# Altium project Oscope_Boards.PrjPcb
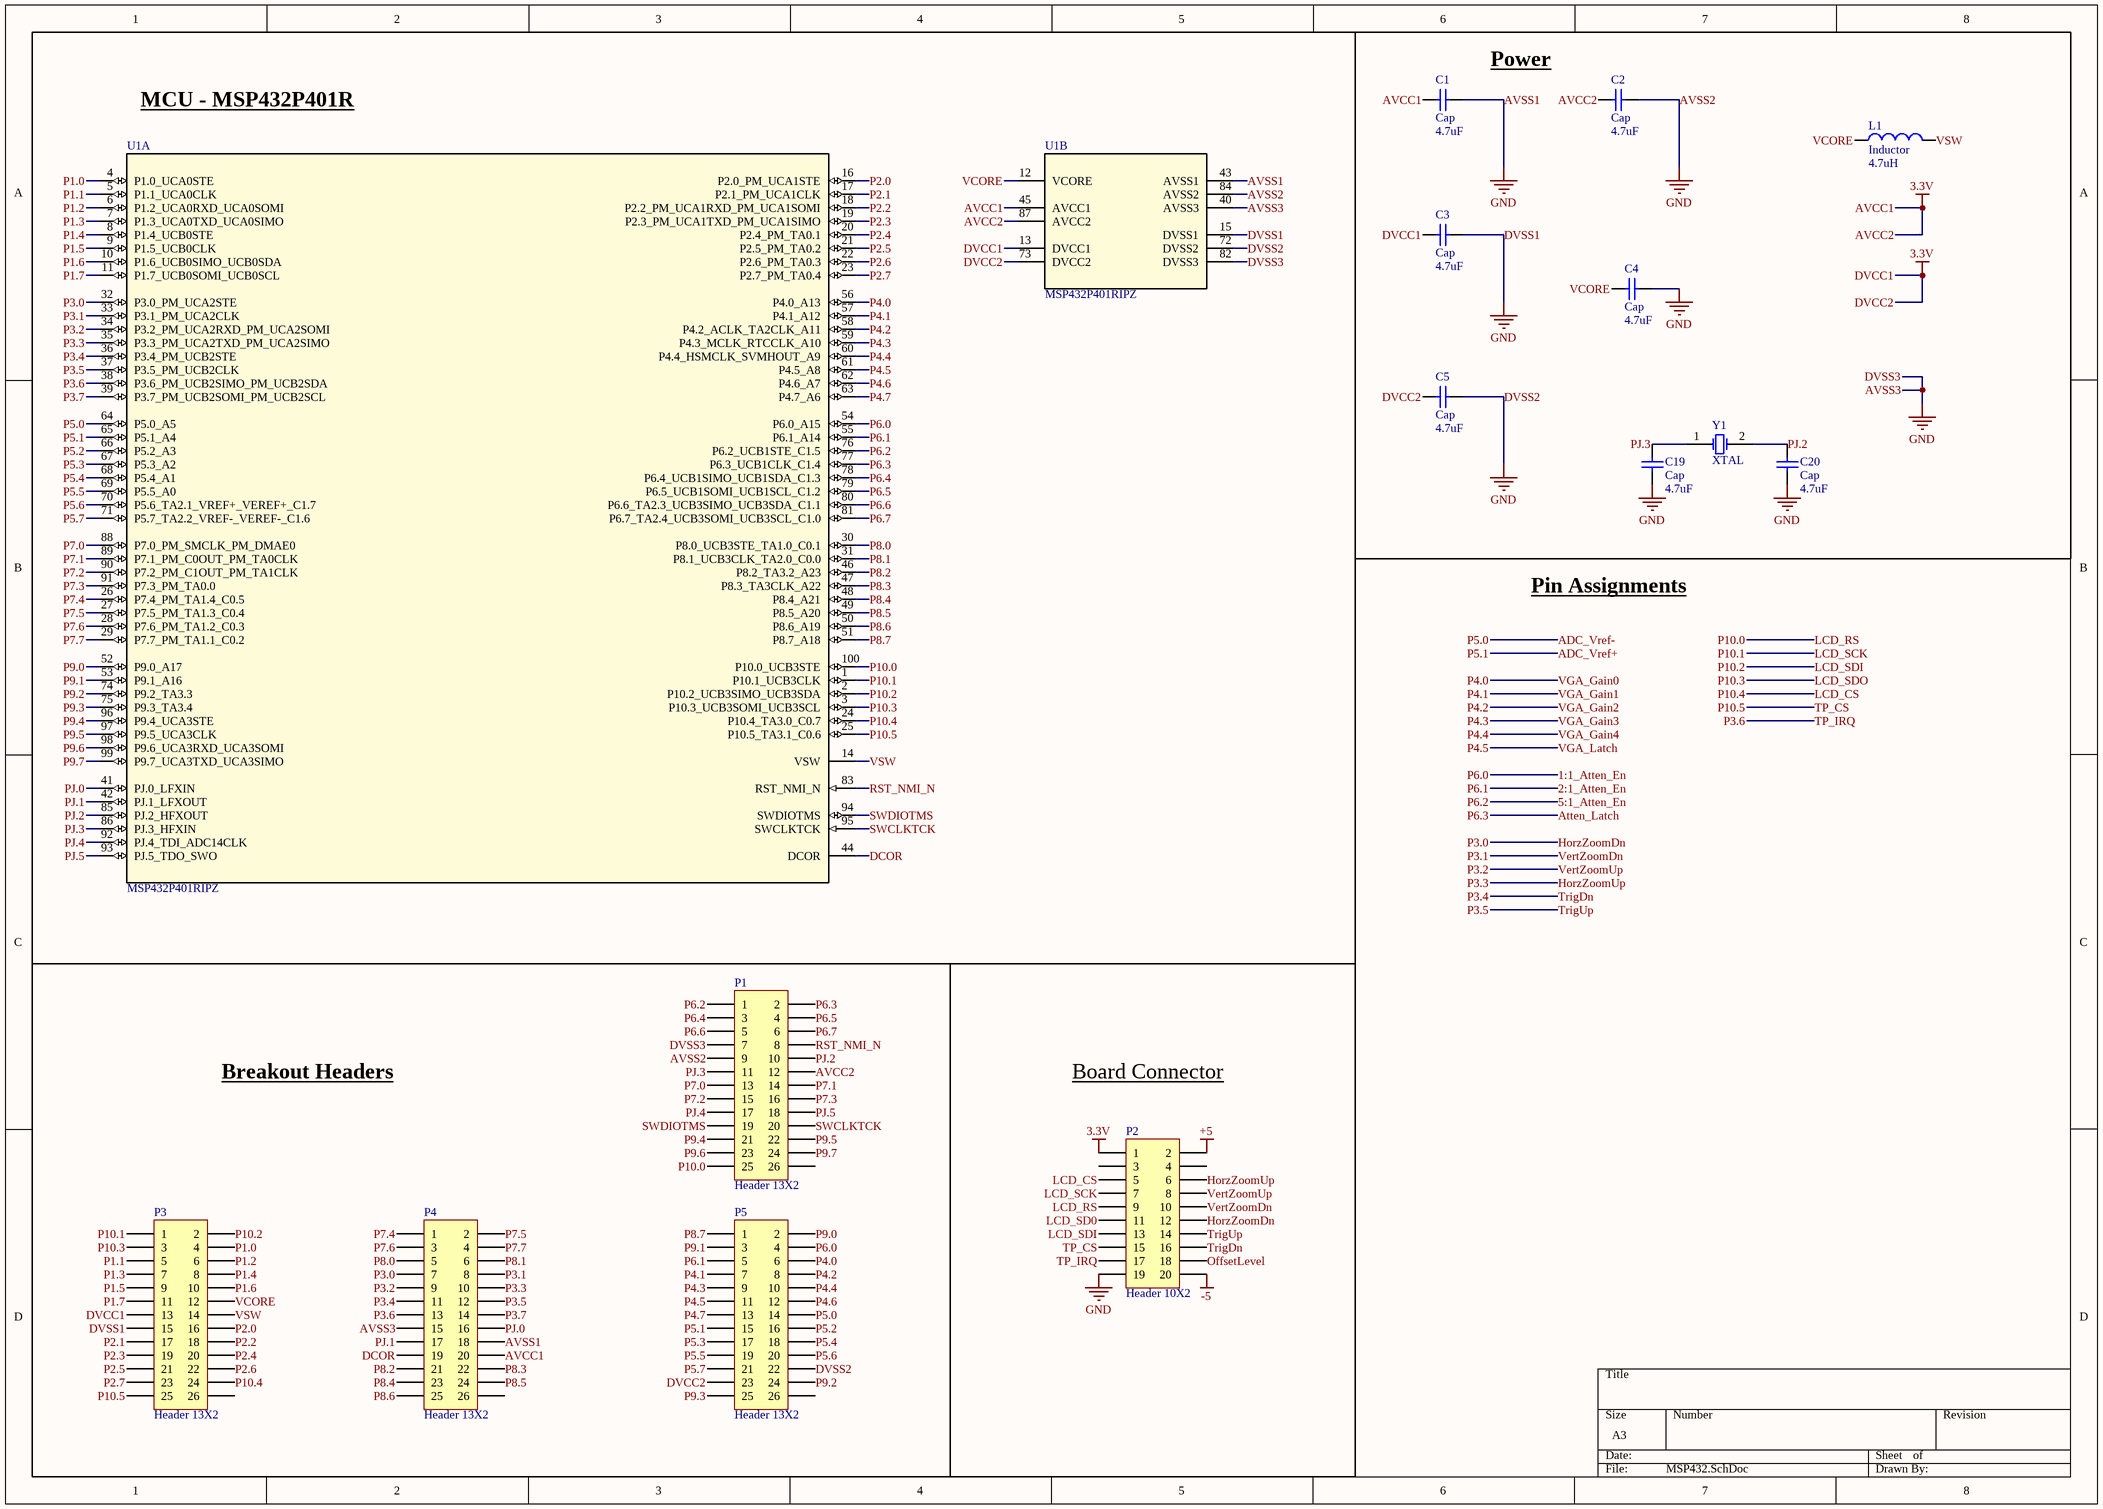
[diagram p0: MSP432.SchDoc]
4 sheets, 64 parts. Net scope: global (net labels, ports and power ports of the same name join across sheets).
Board files: InterfaceBoard.PcbDoc, MainBoard.PcbDoc, EvalBoard.PcbDoc
Sheets:
  MSP432.SchDoc
  FrontEndCircuit.SchDoc
  InterfaceBoard.SchDoc
  PowerCircuit.SchDoc

## Sheet MSP432.SchDoc
size A3

### Parts
C1  Cap  value 4.7uF  [6-0805_N]
C2  Cap  value 4.7uF  [6-0805_N]
C3  Cap  value 4.7uF  [6-0805_N]
C4  Cap  value 4.7uF  [6-0805_N]
C5  Cap  value 4.7uF  [6-0805_N]
C19  Cap  value 4.7uF  [6-0805_N]
C20  Cap  value 4.7uF  [6-0805_N]
L1  Inductor  value 4.7uH  [6-0805_N]
P1  Header 13X2  [HDR2X13]
P2  Header 10X2  [HDR2X10]
P3  Header 13X2  [HDR2X13]
P4  Header 13X2  [HDR2X13]
P5  Header 13X2  [HDR2X13]
U1  MSP432P401RIPZ  [PZ0100A_N]  (parts A,B of 2)
Y1  XTAL  [HC-49U]

### Blocks framed on the sheet
MCU - MSP432P401R: U1
Power: C1-C5 C19 C20 L1 Y1
Breakout Headers: P1 P3-P5
Board Connector: P2

### Nets
+5: P2.2
-5: P2.20
AVCC1: C1.1 C2.1 C3.1 C5.1 P1.12 P2.1 P3.13 P4.20 P5.23 U1.13(DVCC1) U1.45(AVCC1) U1.73(DVCC2) U1.87(AVCC2)  [also labelled 3.3V, AVCC2, DVCC1, DVCC2]
AVSS1: C1.2 C2.2 C3.2 C4.2 C5.2 C19.1 C20.2 P1.7 P1.9 P2.19 P3.15 P4.15 P4.18 P5.22 U1.15(DVSS1) U1.40(AVSS3) U1.43(AVSS1) U1.72(DVSS2) U1.82(DVSS3) U1.84(AVSS2)  [also labelled AVSS2, AVSS3, DVSS1, DVSS2, DVSS3, GND]
1:1_Atten_En: P5.4 U1.54(P6.0_A15)  [also labelled P6.0]
2:1_Atten_En: P5.5 U1.55(P6.1_A14)  [also labelled P6.1]
5:1_Atten_En: P1.1 U1.76(P6.2_UCB1STE_C1.5)  [also labelled P6.2]
ADC_Vref+: P5.15 U1.65(P5.1_A4)  [also labelled P5.1]
ADC_Vref-: P5.14 U1.64(P5.0_A5)  [also labelled P5.0]
Atten_Latch: P1.2 U1.77(P6.3_UCB1CLK_C1.4)  [also labelled P6.3]
DCOR: P4.19 U1.44(DCOR)
HorzZoomDn: P2.12 P4.7 U1.32(P3.0_PM_UCA2STE)  [also labelled P3.0]
HorzZoomUp: P2.6 P4.10 U1.35(P3.3_PM_UCA2TXD_PM_UCA2SIMO)  [also labelled P3.3]
LCD_CS: P2.5 P3.24 U1.24(P10.4_TA3.0_C0.7)  [also labelled P10.4]
LCD_RS: P1.25 P2.9 U1.100(P10.0_UCB3STE)  [also labelled P10.0]
LCD_SCK: P2.7 P3.1 U1.1(P10.1_UCB3CLK)  [also labelled P10.1]
LCD_SD0: P2.11
LCD_SDI: P2.13 P3.2 U1.2(P10.2_UCB3SIMO_UCB3SDA)  [also labelled P10.2]
LCD_SDO: P3.3 U1.3(P10.3_UCB3SOMI_UCB3SCL)  [also labelled P10.3]
OffsetLevel: P2.18
P1.0: P3.4 U1.4(P1.0_UCA0STE)
P1.1: P3.5 U1.5(P1.1_UCA0CLK)
P1.2: P3.6 U1.6(P1.2_UCA0RXD_UCA0SOMI)
P1.3: P3.7 U1.7(P1.3_UCA0TXD_UCA0SIMO)
P1.4: P3.8 U1.8(P1.4_UCB0STE)
P1.5: P3.9 U1.9(P1.5_UCB0CLK)
P1.6: P3.10 U1.10(P1.6_UCB0SIMO_UCB0SDA)
P1.7: P3.11 U1.11(P1.7_UCB0SOMI_UCB0SCL)
P2.0: P3.16 U1.16(P2.0_PM_UCA1STE)
P2.1: P3.17 U1.17(P2.1_PM_UCA1CLK)
P2.2: P3.18 U1.18(P2.2_PM_UCA1RXD_PM_UCA1SOMI)
P2.3: P3.19 U1.19(P2.3_PM_UCA1TXD_PM_UCA1SIMO)
P2.4: P3.20 U1.20(P2.4_PM_TA0.1)
P2.5: P3.21 U1.21(P2.5_PM_TA0.2)
P2.6: P3.22 U1.22(P2.6_PM_TA0.3)
P2.7: P3.23 U1.23(P2.7_PM_TA0.4)
P3.1: P2.10 P4.8 U1.33(P3.1_PM_UCA2CLK)  [also labelled VertZoomDn]
P3.2: P2.8 P4.9 U1.34(P3.2_PM_UCA2RXD_PM_UCA2SOMI)  [also labelled VertZoomUp]
P3.4: P2.16 P4.11 U1.36(P3.4_PM_UCB2STE)  [also labelled TrigDn]
P3.5: P2.14 P4.12 U1.37(P3.5_PM_UCB2CLK)  [also labelled TrigUp]
P3.6: P2.17 P4.13 U1.38(P3.6_PM_UCB2SIMO_PM_UCB2SDA)  [also labelled TP_IRQ]
P3.7: P4.14 U1.39(P3.7_PM_UCB2SOMI_PM_UCB2SCL)
P4.0: P5.6 U1.56(P4.0_A13)  [also labelled VGA_Gain0]
P4.1: P5.7 U1.57(P4.1_A12)  [also labelled VGA_Gain1]
P4.2: P5.8 U1.58(P4.2_ACLK_TA2CLK_A11)  [also labelled VGA_Gain2]
P4.3: P5.9 U1.59(P4.3_MCLK_RTCCLK_A10)  [also labelled VGA_Gain3]
P4.4: P5.10 U1.60(P4.4_HSMCLK_SVMHOUT_A9)  [also labelled VGA_Gain4]
P4.5: P5.11 U1.61(P4.5_A8)  [also labelled VGA_Latch]
P4.6: P5.12 U1.62(P4.6_A7)
P4.7: P5.13 U1.63(P4.7_A6)
P5.2: P5.16 U1.66(P5.2_A3)
P5.3: P5.17 U1.67(P5.3_A2)
P5.4: P5.18 U1.68(P5.4_A1)
P5.5: P5.19 U1.69(P5.5_A0)
P5.6: P5.20 U1.70(P5.6_TA2.1_VREF+_VEREF+_C1.7)
P5.7: P5.21 U1.71(P5.7_TA2.2_VREF-_VEREF-_C1.6)
P6.4: P1.3 U1.78(P6.4_UCB1SIMO_UCB1SDA_C1.3)
P6.5: P1.4 U1.79(P6.5_UCB1SOMI_UCB1SCL_C1.2)
P6.6: P1.5 U1.80(P6.6_TA2.3_UCB3SIMO_UCB3SDA_C1.1)
P6.7: P1.6 U1.81(P6.7_TA2.4_UCB3SOMI_UCB3SCL_C1.0)
P7.0: P1.13 U1.88(P7.0_PM_SMCLK_PM_DMAE0)
P7.1: P1.14 U1.89(P7.1_PM_C0OUT_PM_TA0CLK)
P7.2: P1.15 U1.90(P7.2_PM_C1OUT_PM_TA1CLK)
P7.3: P1.16 U1.91(P7.3_PM_TA0.0)
P7.4: P4.1 U1.26(P7.4_PM_TA1.4_C0.5)
P7.5: P4.2 U1.27(P7.5_PM_TA1.3_C0.4)
P7.6: P4.3 U1.28(P7.6_PM_TA1.2_C0.3)
P7.7: P4.4 U1.29(P7.7_PM_TA1.1_C0.2)
P8.0: P4.5 U1.30(P8.0_UCB3STE_TA1.0_C0.1)
P8.1: P4.6 U1.31(P8.1_UCB3CLK_TA2.0_C0.0)
P8.2: P4.21 U1.46(P8.2_TA3.2_A23)
P8.3: P4.22 U1.47(P8.3_TA3CLK_A22)
P8.4: P4.23 U1.48(P8.4_A21)
P8.5: P4.24 U1.49(P8.5_A20)
P8.6: P4.25 U1.50(P8.6_A19)
P8.7: P5.1 U1.51(P8.7_A18)
P9.0: P5.2 U1.52(P9.0_A17)
P9.1: P5.3 U1.53(P9.1_A16)
P9.2: P5.24 U1.74(P9.2_TA3.3)
P9.3: P5.25 U1.75(P9.3_TA3.4)
P9.4: P1.21 U1.96(P9.4_UCA3STE)
P9.5: P1.22 U1.97(P9.5_UCA3CLK)
P9.6: P1.23 U1.98(P9.6_UCA3RXD_UCA3SOMI)
P9.7: P1.24 U1.99(P9.7_UCA3TXD_UCA3SIMO)
P10.5: P2.15 P3.25 U1.25(P10.5_TA3.1_C0.6)  [also labelled TP_CS]
PJ.0: P4.16 U1.41(PJ.0_LFXIN)
PJ.1: P4.17 U1.42(PJ.1_LFXOUT)
PJ.2: C20.1 P1.10 U1.85(PJ.2_HFXOUT) Y1.2(OSC2)
PJ.3: C19.2 P1.11 U1.86(PJ.3_HFXIN) Y1.1(OSC1)
PJ.4: P1.17 U1.92(PJ.4_TDI_ADC14CLK)
PJ.5: P1.18 U1.93(PJ.5_TDO_SWO)
RST_NMI_N: P1.8 U1.83(RST_NMI_N)
SWCLKTCK: P1.20 U1.95(SWCLKTCK)
SWDIOTMS: P1.19 U1.94(SWDIOTMS)
VCORE: C4.1 L1.1 P3.12 U1.12(VCORE)
VSW: L1.2 P3.14 U1.14(VSW)

Not connected (* = marked no-connect by the designer): P1 26; P2 3 4; P3 26; P4 26; P5 26

### Notes on the sheet
- Pin Assignments

### Library data of the parts
C1-C5 C19 C20 = Cap: Capacitor; Published: 8-Jun-2000; LatestRevisionDate: 17-Jul-2002; LatestRevisionNote: Re-released for DXP Platform.; PackageReference: RAD-0.3; Publisher: Altium Limited; PackageDescription: Radial Cap, Thru-Hole; 2 Leads; 0.3 in Pin Spacing
L1 = Inductor: Code_IEC: 1005; Published: 8-Jun-2000; LatestRevisionDate: 29-May-2009; LatestRevisionNote: IPC-7351 Footprint Added.; PackageReference: 0402-A; Publisher: Altium Limited; PackageDescription: Chip Inductor; Code_JEITA: 0402
P1 P3-P5 = Header 13X2: Header, 13-Pin, Dual row; LatestRevisionDate: 17-Jul-2002; LatestRevisionNote: Re-released for DXP Platform.; Publisher: Altium Limited
P2 = Header 10X2: Header, 10-Pin, Dual row; LatestRevisionDate: 17-Jul-2002; LatestRevisionNote: Re-released for DXP Platform.; Publisher: Altium Limited
U1 = MSP432P401RIPZ: No Description Available; PartNumber: XMS432P401RIPZR; Manufacturer: Texas Instruments; CompType: IC; PIN_COUNT: 100; PackageReference: PZ0100A; MountType: SMT; RefDes: RefDes; Type: DEV; Value: Value; Copyright: Copyright (C) 2018 Accelerated Designs. All rights reserved
Y1 = XTAL: Crystal Oscillator; Published: 8-Jun-2000; LatestRevisionDate: 17-Jul-2002; LatestRevisionNote: Re-released for DXP Platform.; PackageReference: R38; Publisher: Altium Limited; PackageDescription: Crystal, Thru-Hole; 2 Leads; Body 3.1 x 8.2 mm (Dia.xH)

## Sheet FrontEndCircuit.SchDoc
size A3
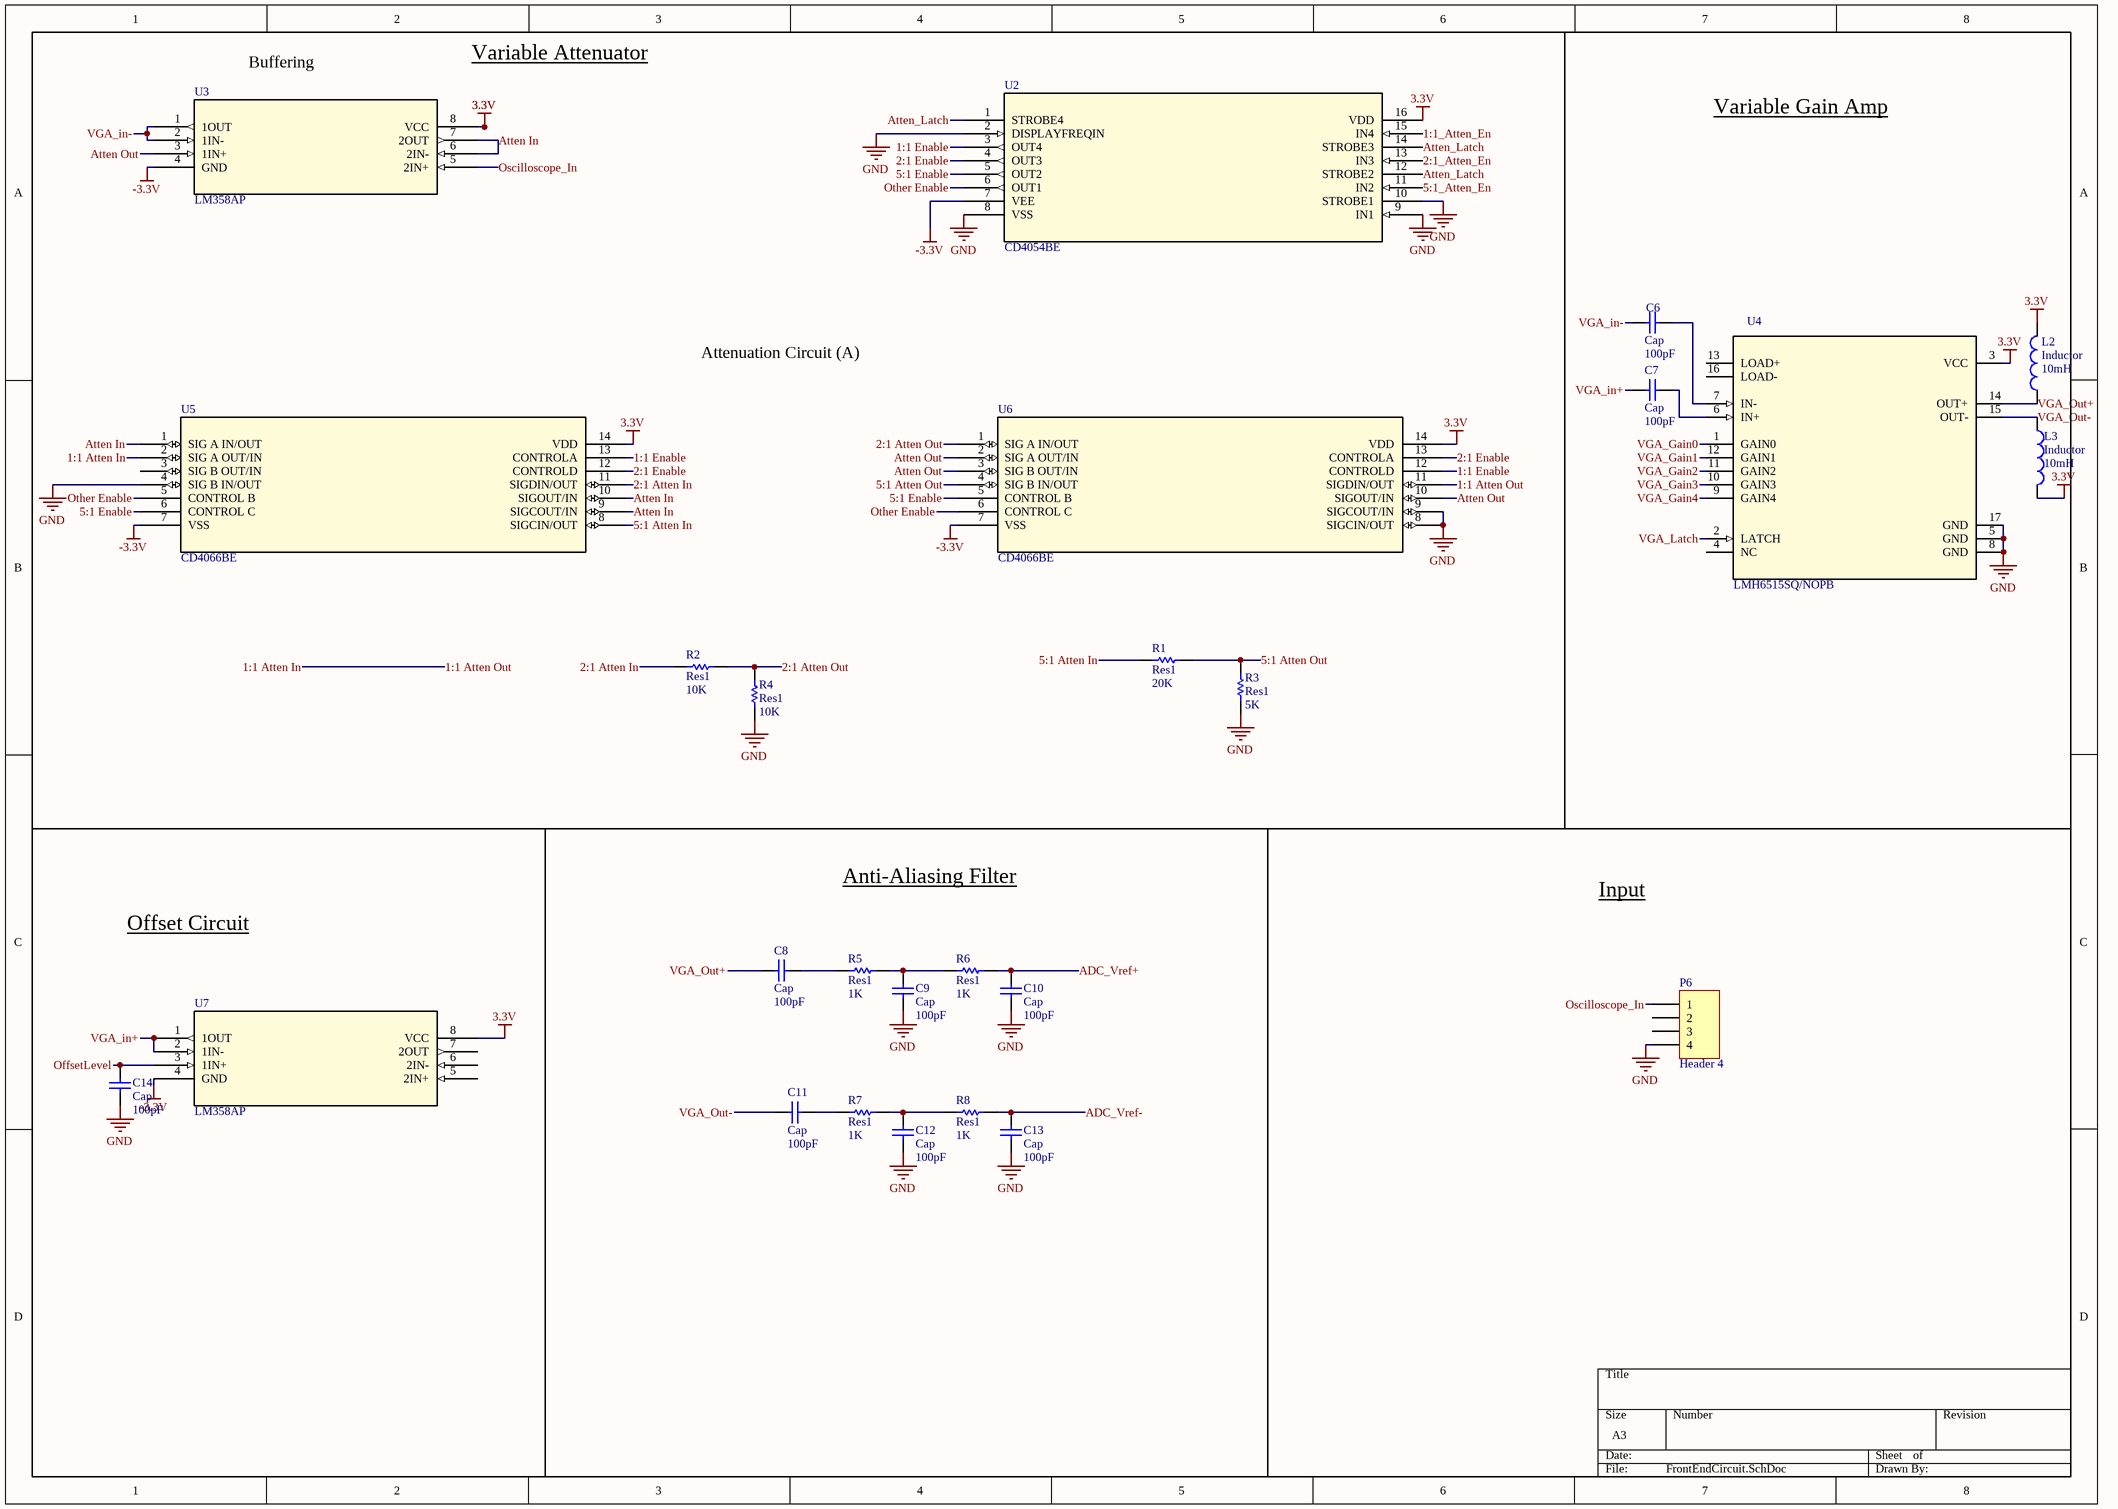
[diagram p1: FrontEndCircuit.SchDoc]

### Parts
C6  Cap  value 100pF  [6-0805_N]
C7  Cap  value 100pF  [6-0805_N]
C8  Cap  value 100pF  [6-0805_N]
C9  Cap  value 100pF  [6-0805_N]
C10  Cap  value 100pF  [6-0805_N]
C11  Cap  value 100pF  [6-0805_N]
C12  Cap  value 100pF  [6-0805_N]
C13  Cap  value 100pF  [6-0805_N]
C14  Cap  value 100pF  [6-0805_N]
L2  Inductor  value 10mH  [6-0805_N]
L3  Inductor  value 10mH  [6-0805_N]
P6  Header 4  [HDR1X4]
R1  Res1  value 20K  [AXIAL-0.3]
R2  Res1  value 10K  [AXIAL-0.3]
R3  Res1  value 5K  [AXIAL-0.3]
R4  Res1  value 10K  [AXIAL-0.3]
R5  Res1  value 1K  [AXIAL-0.3]
R6  Res1  value 1K  [AXIAL-0.3]
R7  Res1  value 1K  [AXIAL-0.3]
R8  Res1  value 1K  [AXIAL-0.3]
U2  CD4054BE  [N16]
U3  LM358AP  [P8]
U4  LMH6515SQ/NOPB  [SQA16A]
U5  CD4066BE  [N14]
U6  CD4066BE  [N14]
U7  LM358AP  [P8]

### Blocks framed on the sheet
Variable Attenuator: R1-R4 U2 U3 U5 U6
Variable Gain Amp: C6 C7 L2 L3 U4
Offset Circuit: C14 U7
Anti-Aliasing Filter: C8-C13 R5-R8
Input: P6

### Nets
3.3V: L2.2 L3.2 U2.16(VDD) U3.8(VCC) U4.3(VCC) U5.14(VDD) U6.14(VDD) U7.8(VCC)  [project net AVCC1]
-3.3V: U2.7(VEE) U3.4(GND) U5.7(VSS) U6.7(VSS) U7.4(GND)
GND: C9.1 C10.1 C12.1 C13.1 C14.1 P6.4 R3.1 R4.1 U2.2(DISPLAYFREQIN) U2.8(VSS) U2.9(IN1) U2.10(STROBE1) U4.5(GND) U4.8(GND) U4.17(GND) U5.4(SIG_B_IN/OUT) U6.8(SIGCIN/OUT) U6.9(SIGCOUT/IN)  [project net AVSS1]
1:1 Atten In: U5.2(SIG_A_OUT/IN) U6.11(SIGDIN/OUT)  [also labelled 1:1 Atten Out]
1:1 Enable: U2.3(OUT4) U5.13(CONTROLA) U6.12(CONTROLD)
1:1_Atten_En: U2.15(IN4)
2:1 Atten In: R2.1 U5.11(SIGDIN/OUT)
2:1 Atten Out: R2.2 R4.2 U6.1(SIG_A_IN/OUT)
2:1 Enable: U2.4(OUT3) U5.12(CONTROLD) U6.13(CONTROLA)
2:1_Atten_En: U2.13(IN3)
5:1 Atten In: R1.1 U5.8(SIGCIN/OUT)
5:1 Atten Out: R1.2 R3.2 U6.4(SIG_B_IN/OUT)
5:1 Enable: U2.5(OUT2) U5.6(CONTROL_C) U6.5(CONTROL_B)
5:1_Atten_En: U2.11(IN2)
ADC_Vref+: C10.2 R6.2
ADC_Vref-: C13.2 R8.2
Atten In: U3.6(2IN-) U3.7(2OUT) U5.1(SIG_A_IN/OUT) U5.9(SIGCOUT/IN) U5.10(SIGOUT/IN)
Atten Out: U3.3(1IN+) U6.2(SIG_A_OUT/IN) U6.3(SIG_B_OUT/IN) U6.10(SIGOUT/IN)
Atten_Latch: U2.1(STROBE4) U2.12(STROBE2) U2.14(STROBE3)
OffsetLevel: C14.2 U7.3(1IN+)
Oscilloscope_In: P6.1 U3.5(2IN+)
Other Enable: U2.6(OUT1) U5.5(CONTROL_B) U6.6(CONTROL_C)
VGA_Gain0: U4.1(GAIN0)  [project net P4.0]
VGA_Gain1: U4.12(GAIN1)  [project net P4.1]
VGA_Gain2: U4.11(GAIN2)  [project net P4.2]
VGA_Gain3: U4.10(GAIN3)  [project net P4.3]
VGA_Gain4: U4.9(GAIN4)  [project net P4.4]
VGA_in+: C7.1 U7.1(1OUT) U7.2(1IN-)
VGA_in-: C6.1 U3.1(1OUT) U3.2(1IN-)
VGA_Latch: U4.2(LATCH)  [project net P4.5]
VGA_Out+: C8.2 L2.1 U4.14(OUT+)
VGA_Out-: C11.2 L3.1 U4.15(OUT-)
NetC6_2: C6.2 U4.7(IN-)
NetC7_2: C7.2 U4.6(IN+)
NetC8_1: C8.1 R5.1
NetC9_2: C9.2 R5.2 R6.1
NetC11_1: C11.1 R7.1
NetC12_2: C12.2 R7.2 R8.1

Not connected (* = marked no-connect by the designer): P6 2 3; U4 4(NC) 13(LOAD+) 16(LOAD-); U5 3(SIG_B_OUT/IN); U7 5(2IN+) 6(2IN-) 7(2OUT)

### Notes on the sheet
- Buffering
- Attenuation Circuit (A)

### Library data of the parts
C6-C14 = Cap: Capacitor; Published: 8-Jun-2000; LatestRevisionDate: 17-Jul-2002; LatestRevisionNote: Re-released for DXP Platform.; PackageReference: RAD-0.3; Publisher: Altium Limited; PackageDescription: Radial Cap, Thru-Hole; 2 Leads; 0.3 in Pin Spacing
L2 L3 = Inductor: Code_IEC: 1005; Published: 8-Jun-2000; LatestRevisionDate: 29-May-2009; LatestRevisionNote: IPC-7351 Footprint Added.; PackageReference: 0402-A; Publisher: Altium Limited; PackageDescription: Chip Inductor; Code_JEITA: 0402
P6 = Header 4: Header, 4-Pin; LatestRevisionDate: 17-Jul-2002; LatestRevisionNote: Re-released for DXP Platform.; Publisher: Altium Limited
R1-R8 = Res1: Resistor; Published: 8-Jun-2000; LatestRevisionDate: 17-Jul-2002; LatestRevisionNote: Re-released for DXP Platform.; PackageReference: AXIAL-0.3; Publisher: Altium Limited; PackageDescription: Axial Device, Thru-Hole; 2 Leads; 0.3 in Pin Spacing
U2 = CD4054BE: CMOS 4-Segment Liquid-Crystal Display Driver; Manufacturer: Texas Instruments; INDUSTRY_STD_PKG_TYPE: PDIP; FAMILY_NAME: NON-INVERTING BUFFER/DRIVER; PIN_COUNT: 16; PACKAGE_DESIGNATOR: N; Datasheet_URL: http://www.ti.com/lit/gpn/CD4054B; GENERIC_PART_NUMBER: CD4054B; Copyright: Copyright (C) 2018 Accelerated Designs. All rights reserved; RefDes: RefDes; Type: DEV
U3 U7 = LM358AP: Dual Operational Amplifier; Manufacturer: Texas Instruments; GENERIC_PART_NUMBER: LM358A; INDUSTRY_STD_PKG_TYPE: PDIP; FAMILY_NAME: STANDARD LINEAR AMPLIFIER; PIN_COUNT: 8; PACKAGE_DESIGNATOR: P; Datasheet_URL: http://www.ti.com/lit/gpn/LM358A; Vendor: Texas Instruments; Manufacturer_Part_Number: LM358AP; Copyright: Copyright (C) 2018 Accelerated Designs. All rights reserved; RefDes: RefDes; Type: DEV
U4 = LMH6515SQ/NOPB: No Description Available; Copyright: Copyright (C) 2018 Accelerated Designs. All rights reserved; RefDes: RefDes; Type: DEV
U5 U6 = CD4066BE: CMOS Quad Bilateral Switch; Manufacturer: Texas Instruments; INDUSTRY_STD_PKG_TYPE: PDIP; FAMILY_NAME: ANALOG SWITCH/MULTIPLEXER (greater than 5V); PIN_COUNT: 14; PACKAGE_DESIGNATOR: N; Datasheet_URL: http://www.ti.com/lit/gpn/CD4066B; GENERIC_PART_NUMBER: CD4066B; Copyright: Copyright (C) 2018 Accelerated Designs. All rights reserved; RefDes: RefDes; Type: DEV

## Sheet InterfaceBoard.SchDoc
size A
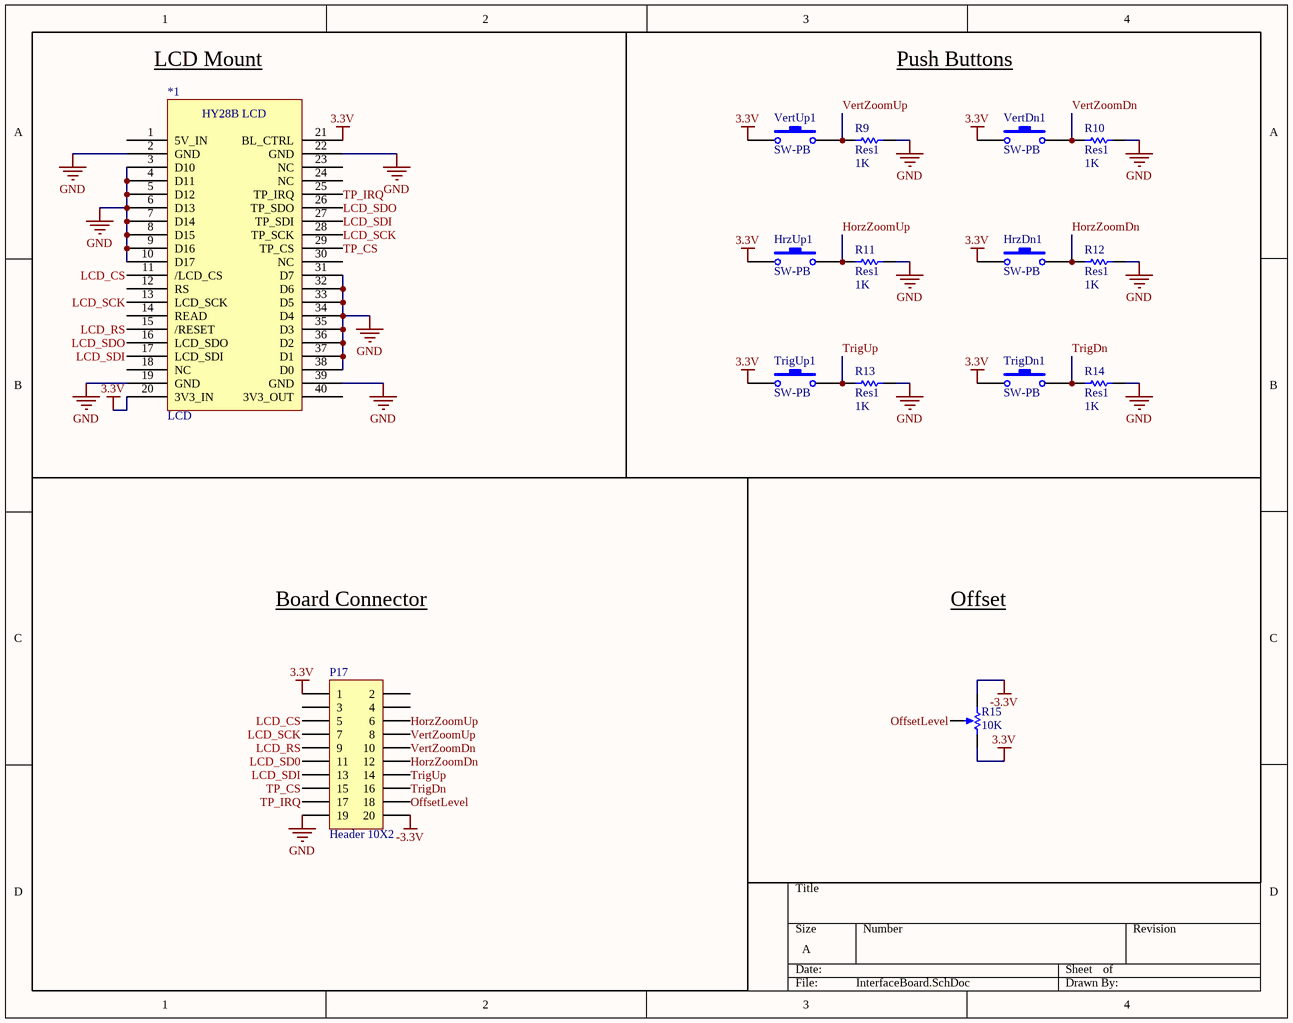
[diagram p2: InterfaceBoard.SchDoc]

### Parts
*1  LCD  [LCD Footprint]
HrzDn1  SW-PB  [SW PB]
HrzUp1  SW-PB  [SW PB]
P17  Header 10X2  [HDR2X10]
R9  Res1  value 1K  [AXIAL-0.3]
R10  Res1  value 1K  [AXIAL-0.3]
R11  Res1  value 1K  [AXIAL-0.3]
R12  Res1  value 1K  [AXIAL-0.3]
R13  Res1  value 1K  [AXIAL-0.3]
R14  Res1  value 1K  [AXIAL-0.3]
R15  value 10K  [BigPot]  (hidden comment: RPot_3)
TrigDn1  SW-PB  [SW PB]
TrigUp1  SW-PB  [SW PB]
VertDn1  SW-PB  [SW PB]
VertUp1  SW-PB  [SW PB]

### Blocks framed on the sheet
LCD Mount: *1
Push Buttons: HrzDn1 HrzUp1 R9-R14 TrigDn1 TrigUp1 VertDn1 VertUp1
Board Connector: P17
Offset: R15

### Nets
3.3V: *1.20(3V3_IN) *1.21(BL_CTRL) HrzDn1.1 HrzUp1.1 P17.1 R15.3(BOT) TrigDn1.1 TrigUp1.1 VertDn1.1 VertUp1.1  [project net AVCC1]
-3.3V: P17.20 R15.1(TOP)
GND: *1.2(GND) *1.3(D10) *1.4(D11) *1.5(D12) *1.6(D13) *1.7(D14) *1.8(D15) *1.9(D16) *1.10(D17) *1.19(GND) *1.22(GND) *1.31(D7) *1.32(D6) *1.33(D5) *1.34(D4) *1.35(D3) *1.36(D2) *1.37(D1) *1.38(D0) *1.39(GND) P17.19 R9.2 R10.2 R11.2 R12.2 R13.2 R14.2  [project net AVSS1]
HorzZoomDn: HrzDn1.2 P17.12 R12.1
HorzZoomUp: HrzUp1.2 P17.6 R11.1
LCD_CS: *1.11(/LCD_CS) P17.5
LCD_RS: *1.15(/RESET) P17.9
LCD_SCK: *1.13(LCD_SCK) *1.28(TP_SCK) P17.7
LCD_SD0: P17.11
LCD_SDI: *1.17(LCD_SDI) *1.27(TP_SDI) P17.13
LCD_SDO: *1.16(LCD_SDO) *1.26(TP_SDO)
OffsetLevel: P17.18 R15.2(TAP)
TP_CS: *1.29(TP_CS) P17.15  [project net P10.5]
TP_IRQ: *1.25(TP_IRQ) P17.17  [project net P3.6]
TrigDn: P17.16 R14.1 TrigDn1.2  [project net P3.4]
TrigUp: P17.14 R13.1 TrigUp1.2  [project net P3.5]
VertZoomDn: P17.10 R10.1 VertDn1.2  [project net P3.1]
VertZoomUp: P17.8 R9.1 VertUp1.2  [project net P3.2]

Not connected (* = marked no-connect by the designer): *1 1(5V_IN) 12(RS) 14(READ) 18(NC) 23(NC) 24(NC) 30(NC) 40(3V3_OUT); P17 2 3 4

### Notes on the sheet
- (in symbol LCD) HY28B LCD

### Library data of the parts
HrzDn1 HrzUp1 TrigDn1 TrigUp1 VertDn1 VertUp1 = SW-PB: DIGIKEY SW400-ND; Published: 24-Mar-1999; LatestRevisionDate: 17-Jul-2002; LatestRevisionNote: Re-released for DXP Platform.; Publisher: Altium Limited
P17 = Header 10X2: Header, 10-Pin, Dual row; LatestRevisionDate: 17-Jul-2002; LatestRevisionNote: Re-released for DXP Platform.; Publisher: Altium Limited
R9-R14 = Res1: Resistor; Published: 8-Jun-2000; LatestRevisionDate: 17-Jul-2002; LatestRevisionNote: Re-released for DXP Platform.; PackageReference: AXIAL-0.3; Publisher: Altium Limited; PackageDescription: Axial Device, Thru-Hole; 2 Leads; 0.3 in Pin Spacing
R15 = RPot: Potentiometer; Sim Note: Enter the Resistance value and the set point into parameter fields.; Set Position: 0.5; Published: 8-Jun-2000; LatestRevisionDate: 17-Jul-2002; LatestRevisionNote: Re-released for DXP Platform.; Publisher: Altium Limited

## Sheet PowerCircuit.SchDoc
size A
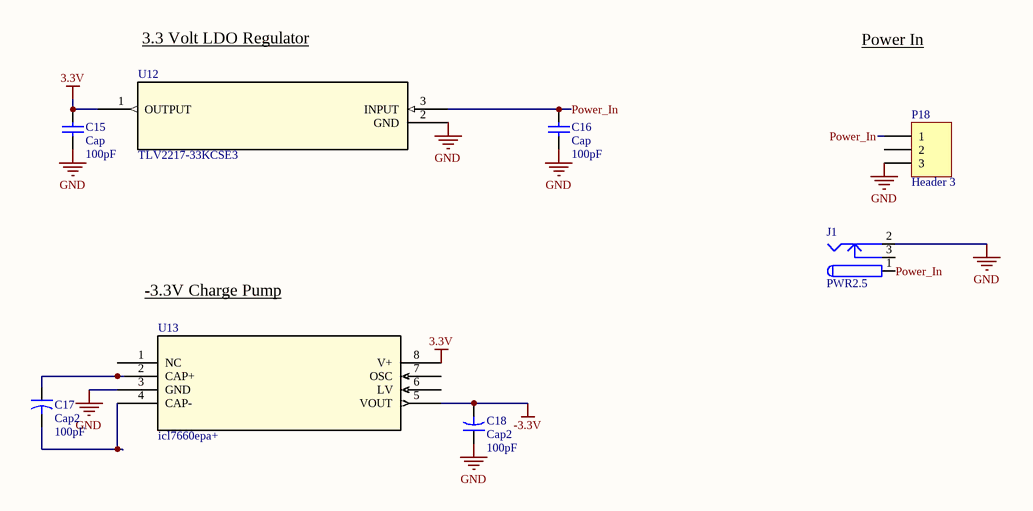
[diagram p3: PowerCircuit.SchDoc]

### Parts
C15  Cap  value 100pF  [RAD-0.3]
C16  Cap  value 100pF  [RAD-0.3]
C17  Cap2  value 100pF  [CAPR5-4X5]
C18  Cap2  value 100pF  [CAPR5-4X5]
J1  PWR2.5  [Power 2.5 fixed]
P18  Header 3  [HDR1X3]
U12  TLV2217-33KCSE3  [KCS3]
U13  icl7660epa+  [21-0043D_8_MXM]

### Nets
3.3V: C15.1 U12.1(OUTPUT) U13.8(V+)  [project net AVCC1]
-3.3V: C18.2 U13.5(VOUT)
GND: C15.2 C16.2 C18.1 J1.2(2A) P18.3 U12.2(GND) U13.3(GND)  [project net AVSS1]
Power_In: C16.1 J1.1(1A) P18.1 U12.3(INPUT)
NetC17_1: C17.1 U13.2(CAP+)
NetC17_2: C17.2 U13.4(CAP-)

Not connected (* = marked no-connect by the designer): J1 3(3A); P18 2; U13 1(NC) 6(LV) 7(OSC)

### Notes on the sheet
- Power In
- 3.3 Volt LDO Regulator
- -3.3V Charge Pump

### Library data of the parts
C15 C16 = Cap: Capacitor; Published: 8-Jun-2000; LatestRevisionDate: 17-Jul-2002; LatestRevisionNote: Re-released for DXP Platform.; PackageReference: RAD-0.3; Publisher: Altium Limited; PackageDescription: Radial Cap, Thru-Hole; 2 Leads; 0.3 in Pin Spacing
C17 C18 = Cap2: Capacitor; Published: 23-Sep-2002; PackageReference: CAPR5-4X5; Publisher: Altium Limited; PackageDescription: Capacitor; 2 Leads
J1 = PWR2.5: Low Voltage Power Supply Connector; Published: 17-Dec-2003; DatasheetDocument: 09-May-2002; Publisher: Altium Limited; ComponentLink1Description: Manufacturer Link; ComponentLink1URL: http://domino.kycon.com/internet/Products.html
P18 = Header 3: Header, 3-Pin; LatestRevisionDate: 17-Jul-2002; LatestRevisionNote: Re-released for DXP Platform.; Publisher: Altium Limited
U12 = TLV2217-33KCSE3: Single Output LDO, 500mA, Fixed(1.8V), Output Accuracy of 2%, Thermal Overload Protection; GENERIC_PART_NUMBER: TLV2217-18; Vendor: Texas Instruments; PACKAGE_DESIGNATOR: KCS; PIN_COUNT: 3; FAMILY_NAME: SINGLE CHANNEL LDO; INDUSTRY_STD_PKG_TYPE: TO-220; Manufacturer_Part_Number: TLV2217-33KCSE3; Datasheet_URL: http://www.ti.com/lit/gpn/TLV2217-18; Manufacturer: Texas Instruments; Copyright: Copyright (C) 2018 Accelerated Designs. All rights reserved; RefDes: RefDes; Type: DEV
U13 = icl7660epa+: No Description Available; Vendor: Maxim Integrated Products; Built_By: EMA_UL_Team; SourceLibrary: Maxim_2014-06-20; Manufacturer_Part_Number: icl7660epa+; Copyright: Copyright (C) 2018 Accelerated Designs. All rights reserved; RefDes: RefDes; Type: DEV

## Nets that join several sheets
-3.3V: FrontEndCircuit (5 pins), InterfaceBoard (P17.20 R15.1), PowerCircuit (C18.2 U13.5)
AVCC1: MSP432 (13 pins), FrontEndCircuit (8 pins), InterfaceBoard (10 pins), PowerCircuit (C15.1 U12.1 U13.8)
AVSS1: MSP432 (20 pins), FrontEndCircuit (18 pins), InterfaceBoard (27 pins), PowerCircuit (7 pins)
1:1_Atten_En: MSP432 (P5.4 U1.54), FrontEndCircuit (U2.15)
2:1_Atten_En: MSP432 (P5.5 U1.55), FrontEndCircuit (U2.13)
5:1_Atten_En: MSP432 (P1.1 U1.76), FrontEndCircuit (U2.11)
ADC_Vref+: MSP432 (P5.15 U1.65), FrontEndCircuit (C10.2 R6.2)
ADC_Vref-: MSP432 (P5.14 U1.64), FrontEndCircuit (C13.2 R8.2)
Atten_Latch: MSP432 (P1.2 U1.77), FrontEndCircuit (U2.1 U2.12 U2.14)
HorzZoomDn: MSP432 (P2.12 P4.7 U1.32), InterfaceBoard (HrzDn1.2 P17.12 R12.1)
HorzZoomUp: MSP432 (P2.6 P4.10 U1.35), InterfaceBoard (HrzUp1.2 P17.6 R11.1)
LCD_CS: MSP432 (P2.5 P3.24 U1.24), InterfaceBoard (*1.11 P17.5)
LCD_RS: MSP432 (P1.25 P2.9 U1.100), InterfaceBoard (*1.15 P17.9)
LCD_SCK: MSP432 (P2.7 P3.1 U1.1), InterfaceBoard (*1.13 *1.28 P17.7)
LCD_SD0: MSP432 (P2.11), InterfaceBoard (P17.11)
LCD_SDI: MSP432 (P2.13 P3.2 U1.2), InterfaceBoard (*1.17 *1.27 P17.13)
LCD_SDO: MSP432 (P3.3 U1.3), InterfaceBoard (*1.16 *1.26)
OffsetLevel: MSP432 (P2.18), FrontEndCircuit (C14.2 U7.3), InterfaceBoard (P17.18 R15.2)
P3.1: MSP432 (P2.10 P4.8 U1.33), InterfaceBoard (P17.10 R10.1 VertDn1.2)
P3.2: MSP432 (P2.8 P4.9 U1.34), InterfaceBoard (P17.8 R9.1 VertUp1.2)
P3.4: MSP432 (P2.16 P4.11 U1.36), InterfaceBoard (P17.16 R14.1 TrigDn1.2)
P3.5: MSP432 (P2.14 P4.12 U1.37), InterfaceBoard (P17.14 R13.1 TrigUp1.2)
P3.6: MSP432 (P2.17 P4.13 U1.38), InterfaceBoard (*1.25 P17.17)
P4.0: MSP432 (P5.6 U1.56), FrontEndCircuit (U4.1)
P4.1: MSP432 (P5.7 U1.57), FrontEndCircuit (U4.12)
P4.2: MSP432 (P5.8 U1.58), FrontEndCircuit (U4.11)
P4.3: MSP432 (P5.9 U1.59), FrontEndCircuit (U4.10)
P4.4: MSP432 (P5.10 U1.60), FrontEndCircuit (U4.9)
P4.5: MSP432 (P5.11 U1.61), FrontEndCircuit (U4.2)
P10.5: MSP432 (P2.15 P3.25 U1.25), InterfaceBoard (*1.29 P17.15)